# EAGLE design Modular Bluetooth Receiver (EAGLE 6.5.0)
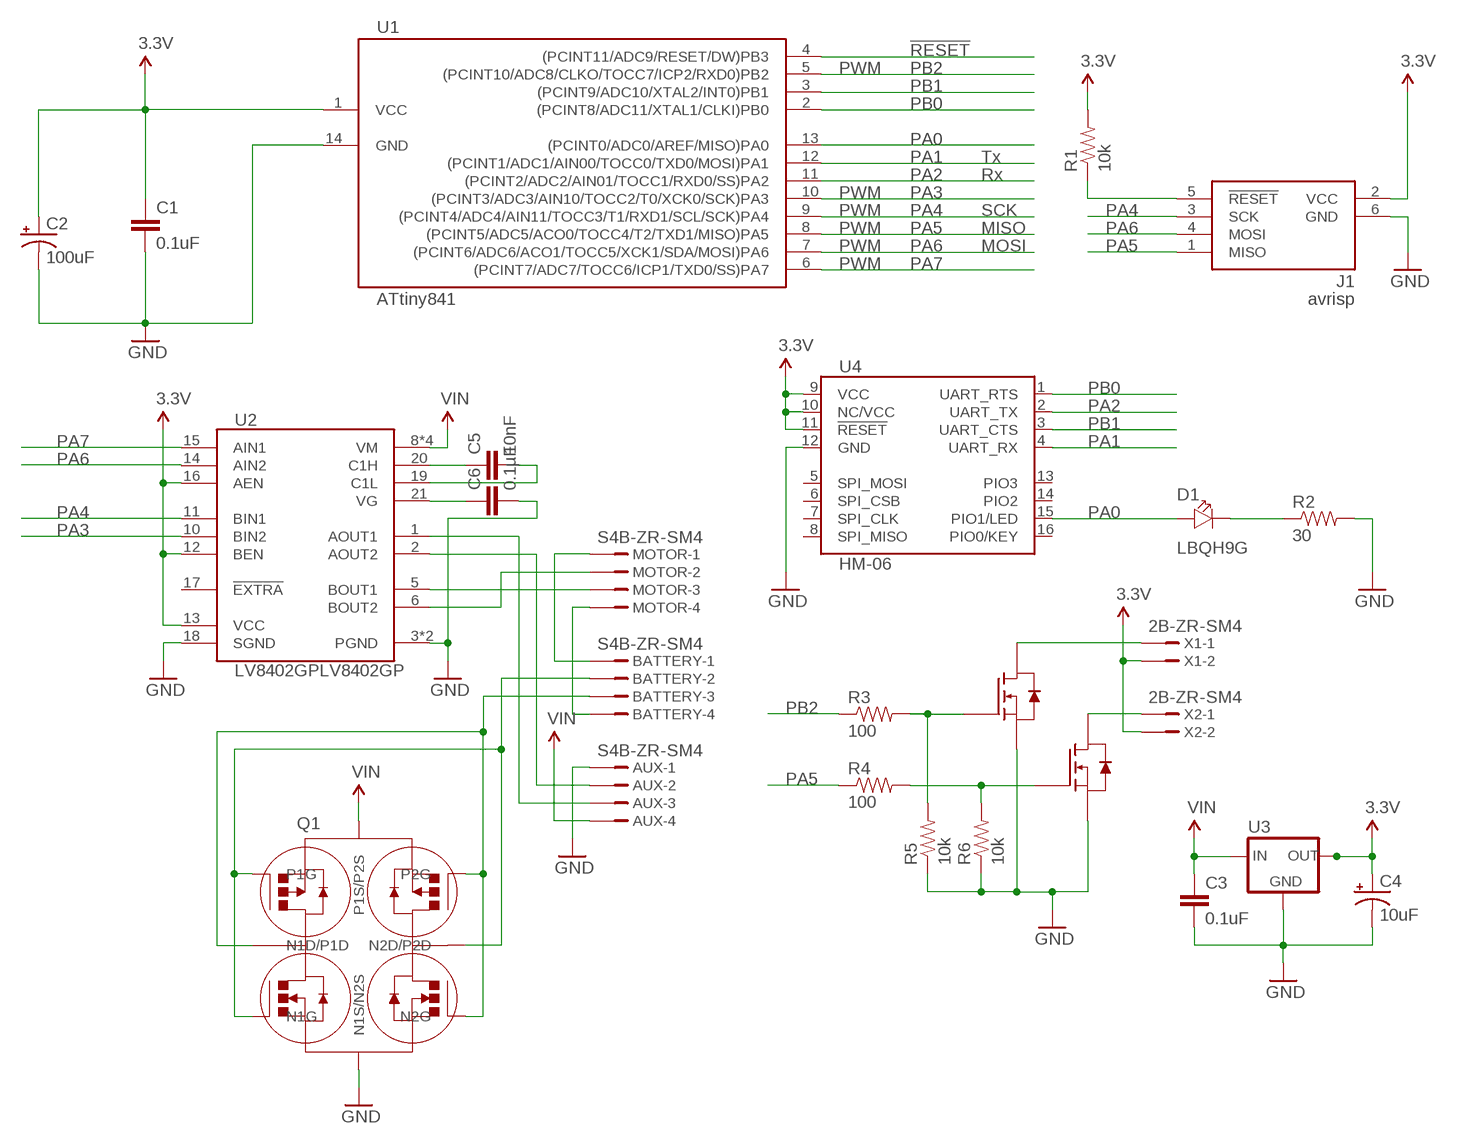
[diagram p0: schematic, sheet 1]

## Parts
AUX  S4B-ZR-SM4  [S4B-ZR-SM4]
BATTERY  S4B-ZR-SM4  [S4B-ZR-SM4]
C1  0.1uF  C0402  [0402]
C2  100uF  C_POL  [1206]
C3  0.1uF  C0402  [0402]
C4  10uF  C_POL  [1206]
C5  10nF  C0402  [0402]
C6  0.1µF  C0402  [0402]
D1  LBQH9G  LED  [0402_POL]
J1  avrisp  AVRISP6_COMPACT  [CON6P2R]
MOTOR  S4B-ZR-SM4  [S4B-ZR-SM4]
Q1  DMHC3025LSD-13  IC_FET_BRIDGESO8  [SO8]
Q2  DMN32D2LV  [SOT-563]
R1  10k  R0402  [0402]
R2  30  R0402  [0402]
R3  100  R0402  [0402]
R4  100  R0402  [0402]
R5  10k  R0402  [0402]
R6  10k  R0402  [0402]
U1  ATtiny841  ATTINY441/841-SSU  [14SOICN]
U2  LV8402GPLV8402GP  [VCT24]
U3  RT9164A  IC_RT9164A  [SOT223]
U4  HM-06  HM-05/06/07HM-05/06/07  [HM-05/06/07]
X1  2B-ZR-SM4  [S2B-ZR-SM4]
X2  2B-ZR-SM4  [S2B-ZR-SM4]

## Nets
3.3V: C1.1 C2.1(+) C4.1(+) J1.2(VCC) R1.2 U1.1(VCC) U2.12(BEN) U2.13(VCC) U2.16(AEN) U3.2(OUT) U3.4(OUT) U4.9(VCC) U4.10(NC/VCC) U4.11(!RESET) X1.2 X2.2
!RESET: J1.5(!RESET) R1.1 U1.4((PCINT11/ADC9/RESET/DW)PB3)
GND: AUX.1 C1.2 C2.2(-) C3.2 C4.2(-) C6.2 J1.6(GND) Q1.P$3(N1S/N2S) Q2.P$1(SOURCE) Q2.P$4(SOURCE) R2.2 R5.1 R6.1 U1.14(GND) U2.3(PGND) U2.4(PGND) U2.18(SGND) U3.1(GND) U4.12(GND)
N$1: BATTERY.1 MOTOR.1
N$2: BATTERY.4 MOTOR.4
N$3: MOTOR.3 U2.5(BOUT1)
N$4: Q2.P$6(DRAIN) X1.1
N$5: AUX.3 U2.1(AOUT1)
N$6: AUX.2 U2.2(AOUT2)
N$7: BATTERY.2 Q1.P$1(N1G) Q1.P$6(N2D/P2D) Q1.P$8(P1G)
N$8: BATTERY.3 Q1.P$2(N1D/P1D) Q1.P$4(N2G) Q1.P$5(P2G)
N$9: C5.2 U2.19(C1L)
N$10: C6.1 U2.21(VG)
N$11: Q2.P$3(DRAIN) X2.1
N$12: D1.P$1 R2.1
N$13: Q2.P$2(GATE) R3.2 R5.2
N$14: Q2.P$5(GATE) R4.2 R6.2
N$15: C5.1 U2.20(C1H)
N$16: MOTOR.2 U2.6(BOUT2)
PA0: D1.P$2 U1.13((PCINT0/ADC0/AREF/MISO)PA0) U4.15(PIO1/LED)
PA1: U1.12((PCINT1/ADC1/AIN00/TOCC0/TXD0/MOSI)PA1) U4.4(UART_RX)
PA2: U1.11((PCINT2/ADC2/AIN01/TOCC1/RXD0/SS)PA2) U4.2(UART_TX)
PA3: U1.10((PCINT3/ADC3/AIN10/TOCC2/T0/XCK0/SCK)PA3) U2.10(BIN2)
PA4: J1.3(SCK) U1.9((PCINT4/ADC4/AIN11/TOCC3/T1/RXD1/SCL/SCK)PA4) U2.11(BIN1)
PA5: J1.1(MISO) R4.1 U1.8((PCINT5/ADC5/ACO0/TOCC4/T2/TXD1/MISO)PA5)
PA6: J1.4(MOSI) U1.7((PCINT6/ADC6/ACO1/TOCC5/XCK1/SDA/MOSI)PA6) U2.14(AIN2)
PA7: U1.6((PCINT7/ADC7/TOCC6/ICP1/TXD0/SS)PA7) U2.15(AIN1)
PB0: U1.2((PCINT8/ADC11/XTAL1/CLKI)PB0) U4.1(UART_RTS)
PB1: U1.3((PCINT9/ADC10/XTAL2/INT0)PB1) U4.3(UART_CTS)
PB2: R3.1 U1.5((PCINT10/ADC8/CLKO/TOCC7/ICP2/RXD0)PB2)
VIN: AUX.4 C3.1 Q1.P$7(P1S/P2S) U2.8(VM) U2.9(VM) U2.22(VM) U2.23(VM) U3.3(IN)
Unconnected: U2.17(!EXTRA) U4.5(SPI_MOSI) U4.6(SPI_CSB) U4.7(SPI_CLK) U4.8(SPI_MISO) U4.13(PIO3) U4.14(PIO2) U4.16(PIO0/KEY)

## Notes on the sheet
- PWM
- Tx
- Rx
- PWM
- PWM | SCK
- PWM | MISO
- PWM | MOSI
- PWM

## Library data of the parts
AUX BATTERY MOTOR = codefox421-parts:?4B-ZR-SM4: ZH CONNECTOR 1.5 mm, 4 pin 1 row, surface mount Source: http://www.jst.com ... eZH.pdf <http://www.jst-mfg.com/product/pdf/eng/eZH.pdf>; MF: FARNELL; MPN: S4B-ZR(LF)(SN); OC_FARNELL: 9491830; OC_NEWARK: 38K8076
C1 = brickster:C; BOM: EXCLUDE; PARTNO: 0603YC104KAT2A
C2 = brickster:C_POL; BOM: EXCLUDE; PARTNO: MCTT21X106M6R3CT
C3 C5 C6 = brickster:C
C4 = brickster:C_POL
D1 = brickster:LED
J1 = bt_avr:AVRISP6: 6-pin dual-row connector for Atmel AVRISP programmer interface
Q1 = brickster:IC_FET_BRIDGE
Q2 = codefox421-parts:DMN32D2LV
R1 R5 R6 = brickster:R; PARTNO: ERJ-3GEYJ103V
R2-R4 = brickster:R
U1 = bt_avr:ATTINY441/841: ATtiny441, ATtiny841 AVR Microcontroller The high-performance Atmel picoPower 8-bit AVR RISC-based microcontroller combines 4KB ISP flash memory, 512-Byte EEPROM, 128B SRAM, 12 general purpose I/O lines, 32 general purpose working registers, an 8-bit timer/counter with two PWM channels, two 16-bit timer/counters with two PWM channels, internal and external interrupts, an 12-channel 10-bit A/D converter, 2 On-chip analog comparators, 2 full duplex USARTs with Start Frame wake up from power down, master/slave SPI serial interface, slave I2C serial interface, programmable gain stage (1x, 20x, and 100x) for 12 differential ADC channel pairs, programmable watchdog timer with internal oscillator, internal calibrated oscillator, and four software selectable power saving modes. The device operates between 1.7-5.5 volts. datasheet.pdf <http://www.atmel.com/Images/Atmel-8495-8-bit-AVR-Microcontrollers-ATtiny441-ATtiny841_Datasheet.pdf>
U2 = codefox421-parts:LV8402GP
U3 = brickster:IC_RT9164A
U4 = codefox421-parts:HM-05/06/07: HM-05, HM-06, HM-07 Bluetooth transceiver Source: http://www.jnhuamao.cn/bluetooth.asp
X1 X2 = codefox421-parts:?2B-ZR-SM4: ZH CONNECTOR 1.5 mm, 2 pin 1 row, surface mount Source: http://www.jst.com ... eZH.pdf <http://www.jst-mfg.com/product/pdf/eng/eZH.pdf>

## Board
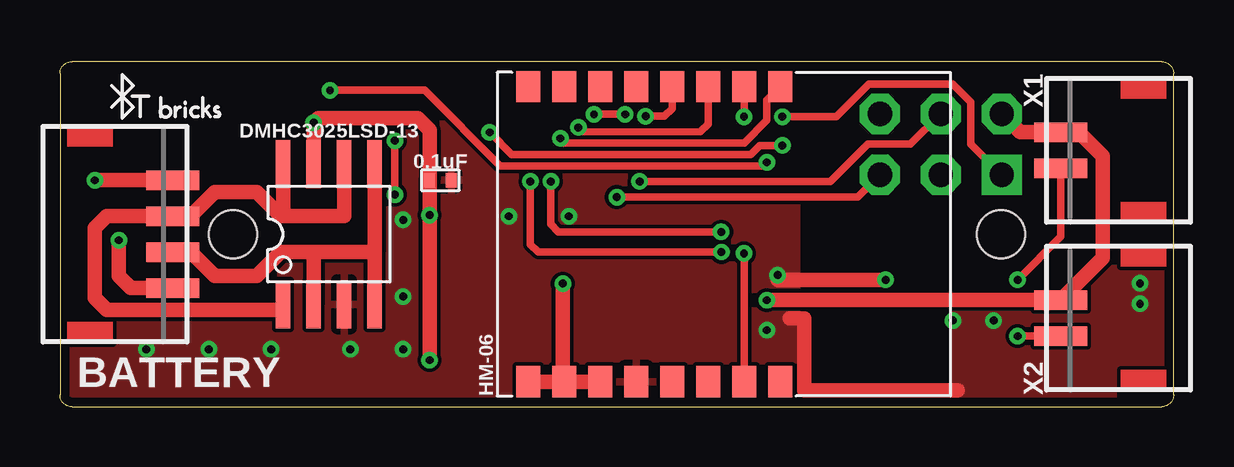
[diagram p1: board, top side]
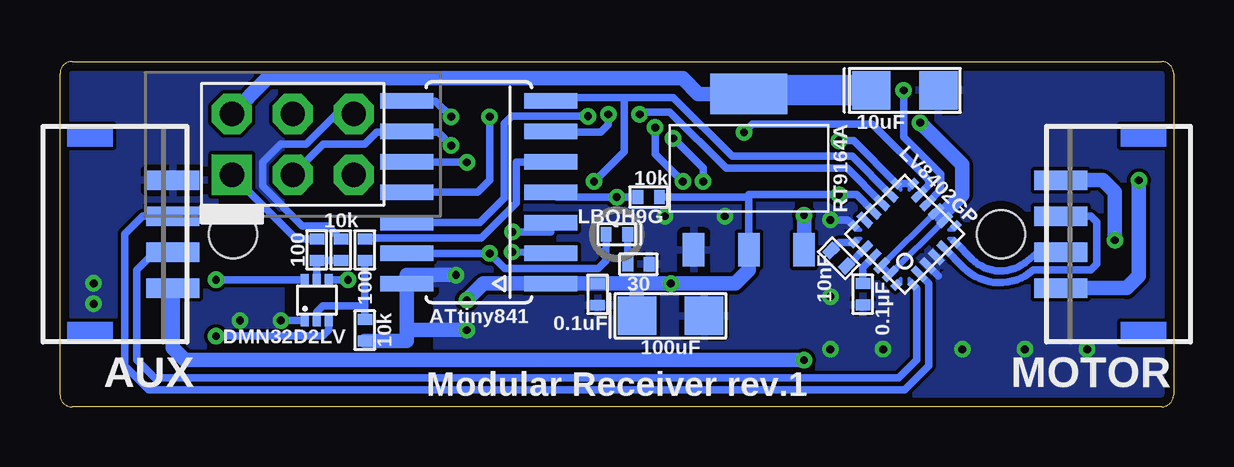
[diagram p2: board, bottom side, seen from below]

Size 46.4 x 14.4 mm. Coordinates in mm from the lower left corner, seen from the top.
Outline: 0.5,0 45.9,0 arc90 46.4,0.5 46.4,13.9 arc90 45.9,14.4 0.5,14.4 arc90 0,13.9 0,0.5 arc90 0.5,0
Copper layers (1*16): Top 0.0356mm / dielectric 1.5011mm / Bottom 0.0356mm
Design rules "LaenPCBOrder *": minimum track width 6mil, minimum drill 13mil, track to track 6mil, track to pad 6mil, pad to pad 6mil, via to via 6mil, smd to smd 6mil, copper to edge 15mil, drill to drill 6mil, minimum pad ring 7mil, minimum via ring 7mil, stop-mask expansion 2mil, vias tented up to drill 13mil, thermal gap 10mil
Holes 2 mm at 7.2,7.2 39.2,7.2

### Footprints (pad centres in the part's own frame; a part is rotated, then mirrored left to right if it is on the bottom)
S4B-ZR-SM4 = smd 0.8 x 2.2: 1 -2.25,5.4; 2 -0.75,5.4; 3 0.75,5.4; 4 2.25,5.4
0402 = smd 0.45 x 0.6: 1 -0.45,0; 2 0.45,0
1206 = smd 1.6 x 1.6: 1 -1.4,0; 2 1.4,0
0402_POL = smd 0.45 x 0.6: P$1 0.45,0; P$2 -0.45,0
CON6P2R = drill 1.016 pad 1.676 square: 1 -2.54,-1.27 | drill 1.016 pad 1.676 octagon: 2 -2.54,1.27; 3 0,-1.27; 4 0,1.27; 5 2.54,-1.27; 6 2.54,1.27
SO8 = smd 0.6 x 2: P$1 -1.905,-2.925; P$2 -0.635,-2.925; P$3 0.635,-2.925; P$4 1.905,-2.925; P$5 1.905,2.925; P$6 0.635,2.925; P$7 -0.635,2.925; P$8 -1.905,2.925
SOT-563 = smd 0.5 x 0.325: P$1 -0.85,0.5; P$2 -0.85,0; P$3 -0.85,-0.5; P$4 0.85,-0.5; P$5 0.85,0; P$6 0.85,0.5
14SOICN = smd 0.66 x 2.2: 1 -3.81,-3; 2 -2.54,-3; 3 -1.27,-3; 4 0,-3; 5 1.27,-3; 6 2.54,-3; 7 3.81,-3; 8 3.81,3; 9 2.54,3; 10 1.27,3; 11 0,3; 12 -1.27,3; 13 -2.54,3; 14 -3.81,3
VCT24 = smd 0.4 x 0.3: 1 -1.75,1.25; 6 -1.75,-1.25; 13 1.75,-1.25; 18 1.75,1.25 | smd 0.7 x 0.3: 2 -1.6,0.75; 3 -1.6,0.25; 4 -1.6,-0.25; 5 -1.6,-0.75; 14 1.6,-0.75; 15 1.6,-0.25; 16 1.6,0.25; 17 1.6,0.75 | smd 0.3 x 0.4: 7 -1.25,-1.75; 12 1.25,-1.75; 19 1.25,1.75; 24 -1.25,1.75 | smd 0.3 x 0.7: 8 -0.75,-1.6; 9 -0.25,-1.6; 10 0.25,-1.6; 11 0.75,-1.6; 20 0.75,1.6; 21 0.25,1.6; 22 -0.25,1.6; 23 -0.75,1.6
SOT223 = smd 0.9 x 1.4: 1 -2.3,-3.4; 2 0,-3.4; 3 2.3,-3.4 | smd 3.2 x 1.7: 4 0,3.1
HM-05/06/07 = smd 1.3 x 1: 1 -6.15,0; 2 -6.15,-1.5; 3 -6.15,-3; 4 -6.15,-4.5; 5 -6.15,-6; 6 -6.15,-7.5; 7 -6.15,-9; 8 -6.15,-10.5; 9 6.15,-10.5; 10 6.15,-9; 11 6.15,-7.5; 12 6.15,-6; 13 6.15,-4.5; 14 6.15,-3; 15 6.15,-1.5; 16 6.15,0
S2B-ZR-SM4 = smd 0.8 x 2.2: 1 -0.75,5.4; 2 0.75,5.4

### Placement (x,y rotation side)
AUX  47.1,7.2 270 bottom
BATTERY  -0.7,7.2 270 top
C1  24,4.69 270 bottom
C2  20.96,3.8 0 bottom
C3  15.85,9.45 0 top
C4  11.2,13.2 0 bottom
C5  13.95,6.2 135 bottom
C6  12.95,4.7 270 bottom
D1  23.2,7.2 0 bottom
J1  36.7,10.95 0 bottom
MOTOR  -0.7,7.2 90 bottom
Q1  11.2,7.2 0 top
Q2  35.7,4.45 90 bottom
R1  21.88,8.75 0 bottom
R2  22.3,5.95 0 bottom
R3  33.7,6.55 270 bottom
R4  35.7,6.55 270 bottom
R5  33.7,3.2 90 bottom
R6  34.7,6.55 270 bottom
U1  28.95,8.95 90 bottom
U2  11.2,7.2 135 bottom
U3  17.7,9.95 0 bottom
U4  30,7.2 270 top
X1  47.1,10.7 90 top
X2  47.1,3.7 90 top

### Tracks (layer width: path | path; a pad name or v marks a point on that pad's centre or on a via)
3.3V  (via drill 0.33)
  Top 0.305: v13.95,8.85 v13.95,11.1
  Top 0.61: U4.9 U4.10 | U4.10 20.95,1.1 v20.95,5.14 | U4.10 U4.11 | J1.2 40.01,11.45 X1.2 42.45,11.45 43.45,10.45 43.45,6.2 X2.2 v29.45,4.45
  Bottom 0.305: 17.7,8.75 R1.2 | 17.7,8.75 17.7,8.85 v13.95,8.85 13.2,8.85 U2.16 | 17.7,8.75 U3.2 | v13.95,11.1 13.33,11.1 U2.13 U2.12
  Bottom 0.61: U3.4 19.8,13.05 20.45,13.7 37.76,13.7 J1.2 | U3.2 17.7,5.7 18.26,5.14 v20.95,5.14 22.36,5.14 | C2.1 22.36,5.14 | v29.45,4.45 28.76,5.14 U1.1 C1.1 22.36,5.14
  Bottom 1.27: U3.4 17.2,13.2 C4.1
!RESET  (via drill 0.33)
  Top 0.305: J1.5 33.23,8.75 v23.2,8.75
  Bottom 0.305: U1.4 25.7,8.85 25.7,8.75 v23.2,8.75 R1.1
GND  (via drill 0.33)
  Top 0.61: v29.9,5.5 29.9,5.3 v34.4,5.3 | 30.4,3.69 31,3.69 31,0.69 37.4,0.69
  Bottom 0.305: U2.3 9.8,5.45 | U2.18 13.57,7.8 v14.3,7.8 | Q2.P$1 v37.2,3.6 | Q2.P$4 v34.4,5.3 | R6.1 35.25,7.55 36.3,7.55 37.95,9.2 37.95,10.2 37.2,10.95 36.15,10.95 34.88,12.22 J1.6
  Bottom 0.61: v29.45,3.2 31.95,3.2 | 31.95,3.2 U1.14 31.95,5.5 v29.9,5.5 | R5.1 31.95,2.75 31.95,3.2
  other vias: 14.3,4.6 14.3,2.4 12.1,2.4 18.7,7.95 21.2,7.95 38.9,3.6 8.8,2.4 6.2,2.4 3.6,2.4 45,5.15 45,4.3
  pour Top: -0.05,14.45 30.7,14.45 30.7,-0.05 -0.05,-0.05
  pour Bottom: -0.05,14.45 30.7,14.45 30.7,-0.05 -0.05,-0.05
  pour Bottom: 37.2,14.45 46.45,14.45 46.45,-0.05 37.2,-0.05
  pour Top: 37.2,14.45 46.45,14.45 46.45,-0.05 37.2,-0.05
N$1  (via drill 0.33)
  Top 0.61: BATTERY.1 v1.45,9.45
  Bottom 0.61: v1.45,9.45 1.45,5.45 1.95,4.95 MOTOR.1
N$2  (via drill 0.33)
  Top 0.61: BATTERY.4 2.95,4.95 2.45,5.45 v2.45,6.95
  Bottom 0.61: v2.45,6.95 2.45,8.95 2.95,9.45 MOTOR.4
N$3
  Bottom 0.305: U2.5 8.74,5.8 arc-86 5.85,5.7 3.45,5.7 3.2,5.95 3.2,7.7 3.45,7.95 MOTOR.3
N$4  (via drill 0.33)
  Top 0.305: v39.9,5.3 41.7,7.1 X1.1
  Bottom 0.305: Q2.P$6 v39.9,5.3
N$5
  Bottom 0.305: U2.1 10.7,4.93 10.7,1.95 11.45,1.2 42.45,1.2 43.2,1.95 43.2,5.7 42.45,6.45 AUX.3
N$6
  Bottom 0.305: U2.2 10.2,5.14 10.2,1.7 11.2,0.7 42.7,0.7 43.7,1.7 43.7,7.2 42.95,7.95 AUX.2
N$7
  Top 0.61: Q1.P$1 9.29,4.05 1.95,4.05 1.45,4.55 1.45,7.45 1.95,7.95 BATTERY.2 5.45,7.95 6.45,8.95 8.2,8.95 9.2,7.95 9.29,7.95 | Q1.P$8 9.29,7.95 | Q1.P$6 11.83,7.95 9.29,7.95
N$8
  Top 0.61: 10.56,6.45 Q1.P$2 | Q1.P$4 13.1,6.45 | 13.1,6.45 10.56,6.45 | Q1.P$5 13.1,6.45 | 10.56,6.45 9.2,6.45 8.2,5.45 6.45,5.45 5.45,6.45 BATTERY.3
N$9
  Bottom 0.305: U2.19 13.94,6.85 C5.2
N$10
  Bottom 0.305: U2.21 12.95,5.8 C6.1
N$11  (via drill 0.33)
  Top 0.305: v39.9,2.95 X2.1
  Bottom 0.305: Q2.P$3 35.2,3.2 35.45,2.95 v39.9,2.95
N$12
  Bottom 0.305: D1.P$1 R2.1
N$13
  Bottom 0.305: Q2.P$2 35.7,3.95 35.45,4.2 33.7,4.2 | 33.7,4.2 R3.2 | 33.7,4.2 R5.2
N$14
  Bottom 0.305: Q2.P$5 R4.2 R6.2
N$15
  Bottom 0.305: U2.20 13.57,5.89 C5.1
N$16
  Bottom 0.305: U2.6 8.38,6.15 arc-82 6.21,6 5.65,6.45 MOTOR.2
PA0  (via drill 0.33)
  Top 0.305: U4.15 v28.5,6.4
  Bottom 0.305: U1.13 v28.5,6.4 27.88,5.78 23.97,5.78 23.65,6.09 D1.P$2
PA1  (via drill 0.33)
  Top 0.305: v24.4,12.12 25.18,12.12 25.5,12.44 U4.4
  Bottom 0.305: U1.12 28.92,7.68 27.9,8.7 27.9,11.81 27.58,12.12 v24.4,12.12
PA2  (via drill 0.33)
  Top 0.305: v28.5,12.1 U4.2
  Bottom 0.305: U1.11 29,8.95 28.5,9.45 v28.5,12.1
PA3  (via drill 0.33)
  Top 0.305: v11.25,13.2 15.2,13.2 18.35,10.05 29.45,10.05 v29.45,10.2
  Bottom 0.305: U2.10 9.7,9.05 9.7,9.7 11.25,11.25 v11.25,13.2 | v29.45,10.2 32.18,10.2 U1.10
PA4  (via drill 0.33)
  Top 0.305: v30.1,10.9 29.15,10.9 28.77,10.52 18.82,10.52 v17.9,11.45
  Bottom 0.305: U2.11 10.2,9.26 10.2,9.45 12.55,11.8 17.55,11.8 v17.9,11.45 | 32.16,11.45 U1.9 | 32.16,11.45 30.65,11.45 v30.1,10.9 | 32.16,11.45 33.2,11.45 33.7,10.95 35.43,10.95 J1.3
PA5  (via drill 0.33)
  Top 0.305: J1.1 37.95,10.97 37.95,12.7 37.2,13.45 33.7,13.45 32.35,12.1 v30.1,12.1
  Bottom 0.305: v30.1,12.1 30.76,12.76 U1.8 | J1.1 36.56,7 R4.1
PA6  (via drill 0.33)
  Top 0.305: J1.4 35.43,10.95 33.65,10.95 32.1,9.4 v24.15,9.4
  Bottom 0.305: U2.14 13.39,10.45 18.4,10.45 20.85,12.9 22.9,12.9 | 22.9,12.9 25.95,12.9 U1.7 | 22.9,12.9 22.9,10.65 v24.15,9.4
PA7  (via drill 0.33)
  Top 0.305: v23.55,12.2 v22.25,12.2
  Bottom 0.305: U2.15 13.6,9.95 18.65,9.95 21,12.3 22.25,12.3 v22.25,12.2 | U1.6 25.71,11.45 23.87,11.45 23.55,11.77 v23.55,12.2
PB0  (via drill 0.33)
  Top 0.305: U4.1 29.45,12.8 29.45,11.95 28.5,11 20.85,11 v20.85,11.2 | v27.56,6.46 19.92,6.46 19.6,6.78 v19.6,9.4
  Bottom 0.305: U1.2 v27.56,6.46 | v19.6,9.4 19.6,9.95 v20.85,11.2
PB1  (via drill 0.33)
  Top 0.305: U4.3 27,11.79 26.68,11.47 21.6,11.47 v21.6,11.65 | v20.45,9.4 20.45,7.62 20.77,7.3 v27.55,7.3
  Bottom 0.305: v21.6,11.65 21.6,10.55 v20.45,9.4 | v27.55,7.3 25.95,7.3 U1.3
PB2
  Bottom 0.305: U1.5 27.4,10.22 27.4,8.5 28.86,7.04 33.7,7.04 R3.1
VIN  (via drill 0.33)
  Top 0.61: Q1.P$7 v10.56,11.85 10.76,12.05 14.9,12.05 15.4,11.55 C3.1 v15.4,8 v15.4,1.95
  Bottom 0.254: U2.22 U2.23 U2.8 U2.9 U2.22
  Bottom 0.305: 9.7,7.95 9.69,7.95 U2.8
  Bottom 0.61: U3.3 v15.4,8 | v10.56,11.85 8.81,10.1 8.81,8.83 9.7,7.95 | v15.4,1.95 41.2,1.95 41.7,2.45 AUX.4

### Text on the board
tNames: HM-06
bNames: LV8402GP | DMN32D2LV | Modular Receiver rev.1